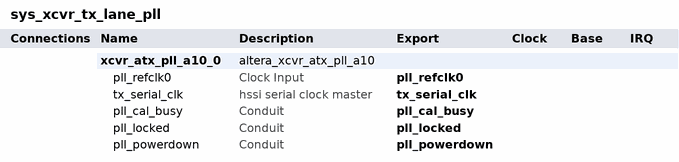
[diagram p0: system contents]
# Platform Designer (Qsys) system sys_xcvr_tx_lane_pll, Arria 10 10AX115S3F45I2SGE2
# Parameters at their usual value, and those the tool derives, are not listed.
package require -exact qsys 15.0
create_system sys_xcvr_tx_lane_pll
set_project_property DEVICE_FAMILY {Arria 10}
set_project_property DEVICE 10AX115S3F45I2SGE2

add_instance xcvr_atx_pll_a10_0 altera_xcvr_atx_pll_a10 15.0
set_instance_property xcvr_atx_pll_a10_0 AUTO_EXPORT true
set_instance_parameter_value xcvr_atx_pll_a10_0 base_device NIGHTFURY5ES2
set_instance_parameter_value xcvr_atx_pll_a10_0 enable_atx_to_fpll_cascade_out 0
set_instance_parameter_value xcvr_atx_pll_a10_0 enable_bonding_clks 0
set_instance_parameter_value xcvr_atx_pll_a10_0 enable_fractional 0
set_instance_parameter_value xcvr_atx_pll_a10_0 enable_manual_configuration 1
set_instance_parameter_value xcvr_atx_pll_a10_0 enable_mcgb 0
set_instance_parameter_value xcvr_atx_pll_a10_0 generate_docs 1
set_instance_parameter_value xcvr_atx_pll_a10_0 pma_width 64
set_instance_parameter_value xcvr_atx_pll_a10_0 select_manual_config false
set_instance_parameter_value xcvr_atx_pll_a10_0 set_auto_reference_clock_frequency 500.0
set_instance_parameter_value xcvr_atx_pll_a10_0 set_fref_clock_frequency 100.0
set_instance_parameter_value xcvr_atx_pll_a10_0 set_k_counter 1
set_instance_parameter_value xcvr_atx_pll_a10_0 set_l_cascade_counter 4
set_instance_parameter_value xcvr_atx_pll_a10_0 set_l_counter 4
set_instance_parameter_value xcvr_atx_pll_a10_0 set_m_counter 50
set_instance_parameter_value xcvr_atx_pll_a10_0 set_manual_reference_clock_frequency 100.0
set_instance_parameter_value xcvr_atx_pll_a10_0 set_output_clock_frequency 5000.0

# exported interfaces
add_interface pll_cal_busy conduit end
set_interface_property pll_cal_busy EXPORT_OF xcvr_atx_pll_a10_0.pll_cal_busy
add_interface pll_locked conduit end
set_interface_property pll_locked EXPORT_OF xcvr_atx_pll_a10_0.pll_locked
add_interface pll_powerdown conduit end
set_interface_property pll_powerdown EXPORT_OF xcvr_atx_pll_a10_0.pll_powerdown
add_interface pll_refclk0 clock sink
set_interface_property pll_refclk0 EXPORT_OF xcvr_atx_pll_a10_0.pll_refclk0
add_interface tx_serial_clk hssi_serial_clock start
set_interface_property tx_serial_clk EXPORT_OF xcvr_atx_pll_a10_0.tx_serial_clk

set_interconnect_requirement {$system} qsys_mm.clockCrossingAdapter HANDSHAKE
set_interconnect_requirement {$system} qsys_mm.enableEccProtection FALSE
set_interconnect_requirement {$system} qsys_mm.insertDefaultSlave FALSE
set_interconnect_requirement {$system} qsys_mm.maxAdditionalLatency 1

save_system sys_xcvr_tx_lane_pll.qsys
